# EasyEDA schematic SCH_ESP32-Simplified_2024-08-01.json
TITLE: ESP32 Tutorial; REV: 1.0; Date: 2024-06-09; Sheet: 1/1; Drawn By: 3004erod; Company: Enrique
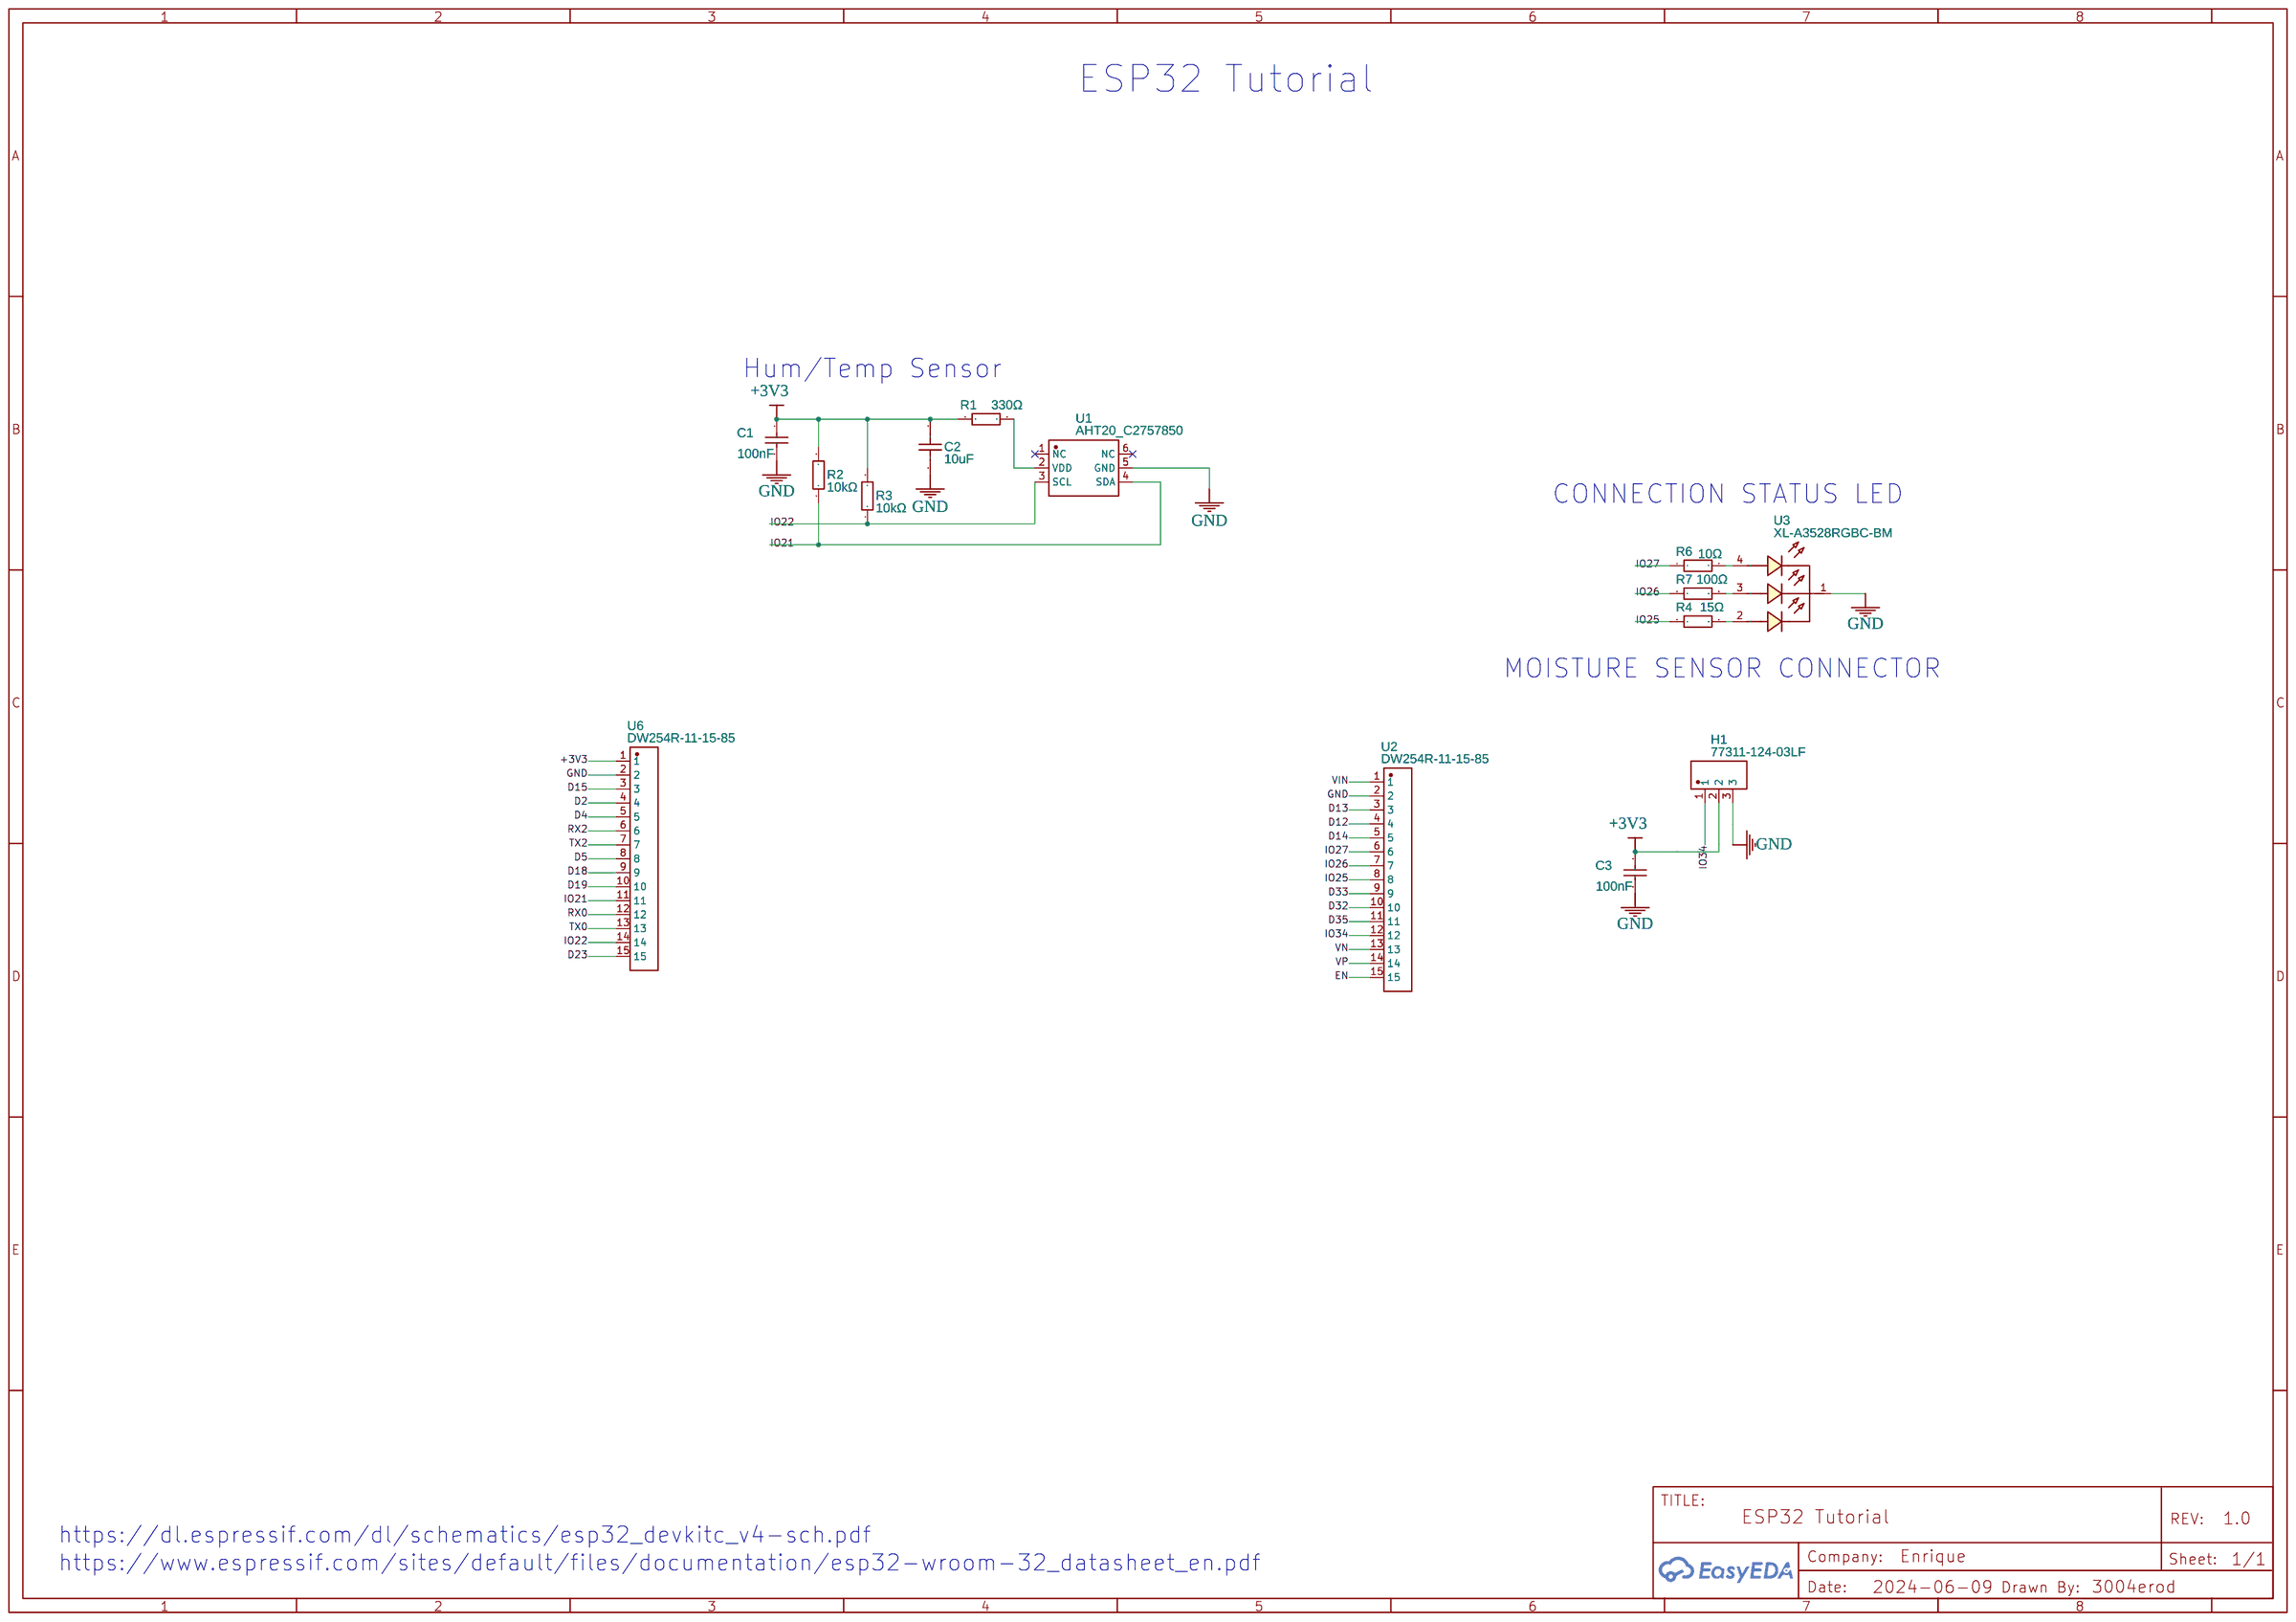
[diagram p0: schematic sheet]

## Parts
C1  100nF  [C0402]
C2  10uF  [C0402]
C3  100nF  [C0402]
H1  77311-124-03LF  [HDR-TH_3P-P2.54-V-M]
R1  330Ω  [R0603]
R2  10kΩ  [R0402]
R3  10kΩ  [R0402]
R4  15Ω  [R0805]
R6  10Ω  [R0603]
R7  100Ω  [R0603]
U1  AHT20_C2757850  [SENSOR-SMD_L3.0-W3.0-P1.00-BR]
U2  DW254R-11-15-85  [HDR-TH_15P-P2.54-V-F]
U3  XL-A3528RGBC-BM  [LED-ARRAY-SMD_4P-L3.2-W2.8-LS3.5-BL_XL-A3528RGBC-BM]
U6  DW254R-11-15-85  [HDR-TH_15P-P2.54-V-F]

## Library data of the parts
C1 C3 = CL05B104KO5NNNC: Supplier: LCSC; Manufacturer: SAMSUNG(三星); Supplier Part: C1525; JLCPCB Part Class: Basic Part
C2 = CL05A106MP5NUNC_C315248: Contributor: LCSC; Supplier: LCSC; Supplier Part: C315248; Manufacturer: SAMSUNG(三星); Manufacturer Part: CL05A106MP5NUNC; JLCPCB Part Class: Extended Part
H1 = 77311-124-03LF: Contributor: lcsc; Supplier: LCSC; Supplier Part: C599043; Manufacturer: Amphenol
R1 = 0603WAF3300T5E: Supplier: LCSC; Manufacturer: UNI-ROYAL(厚声); Supplier Part: C23138; JLCPCB Part Class: Basic Part
R2 R3 = RC0402FR-0710KL: Supplier: LCSC; Manufacturer: YAGEO(国巨); Supplier Part: C60490; JLCPCB Part Class: Extended Part
R4 = 0805W8F150JT5E: Supplier: LCSC; Manufacturer: UNI-ROYAL(厚声); Supplier Part: C17480; JLCPCB Part Class: Extended Part; link: https://lcsc.com/eda_search?q=C17480&%26type=1&ref=editor
R6 = 0603WAF100JT5E: Supplier: LCSC; Manufacturer: UNI-ROYAL(厚声); Supplier Part: C22859; JLCPCB Part Class: Basic Part
R7 = 0603WAF1000T5E: Supplier: LCSC; Manufacturer: UNI-ROYAL(厚声); Supplier Part: C22775; JLCPCB Part Class: Basic Part
U1 = AHT20_C2757850: Contributor: LCSC; Supplier: LCSC; Supplier Part: C2757850; Manufacturer: 广州奥松; Manufacturer Part: AHT20; JLCPCB Part Class: Extended Part
U2 U6 = DW254R-11-15-85: Supplier: LCSC; Supplier Part: C7506613; Manufacturer: DEALON(德艺隆); Contributor: lcsc
U3 = XL-A3528RGBC-BM: Contributor: lcsc; Supplier: LCSC; Supplier Part: C3647023; Manufacturer: XINGLIGHT(成兴光); JLCPCB Part Class: Extended Part

## Nets
+3V3: C1.1 C2.2 C3.1 H1.2 R1.1 R2.2 R3.2 U6.1
GND: C1.2 C2.1 C3.2 H1.3 U1.5(GND) U2.2 U3.1 U6.2
VIN: U2.1
D2: U6.4
D4: U6.5
D5: U6.8
D12: U2.4
D13: U2.3
D14: U2.5
D15: U6.3
D18: U6.9
D19: U6.10
D23: U6.15
D32: U2.10
D33: U2.9
D35: U2.11
EN: U2.15
IO21: R2.1 U1.4(SDA) U6.11
IO22: R3.1 U1.3(SCL) U6.14
IO25: R4.1 U2.8
IO26: R7.1 U2.7
IO27: R6.1 U2.6
IO34: H1.1 U2.12
RX0: U6.12
RX2: U6.6
TX0: U6.13
TX2: U6.7
VN: U2.13
VP: U2.14
Net-(R1-2): R1.2 U1.2(VDD)
Net-(R4-2): R4.2 U3.2
Net-(R6-2): R6.2 U3.4
Net-(R7-2): R7.2 U3.3

Not connected (* = marked no-connect by the designer): U1 1(NC)* 6(NC)*

## Notes on the sheet
- ESP32 Tutorial
- Hum/Temp Sensor
- CONNECTION STATUS LED
- MOISTURE SENSOR CONNECTOR
- https://dl.espressif.com/dl/schematics/esp32_devkitc_v4-sch.pdf
- https://www.espressif.com/sites/default/files/documentation/esp32-wroom-32_datasheet_en.pdf
